# Altium project Nixie Multimeter.PrjPcb
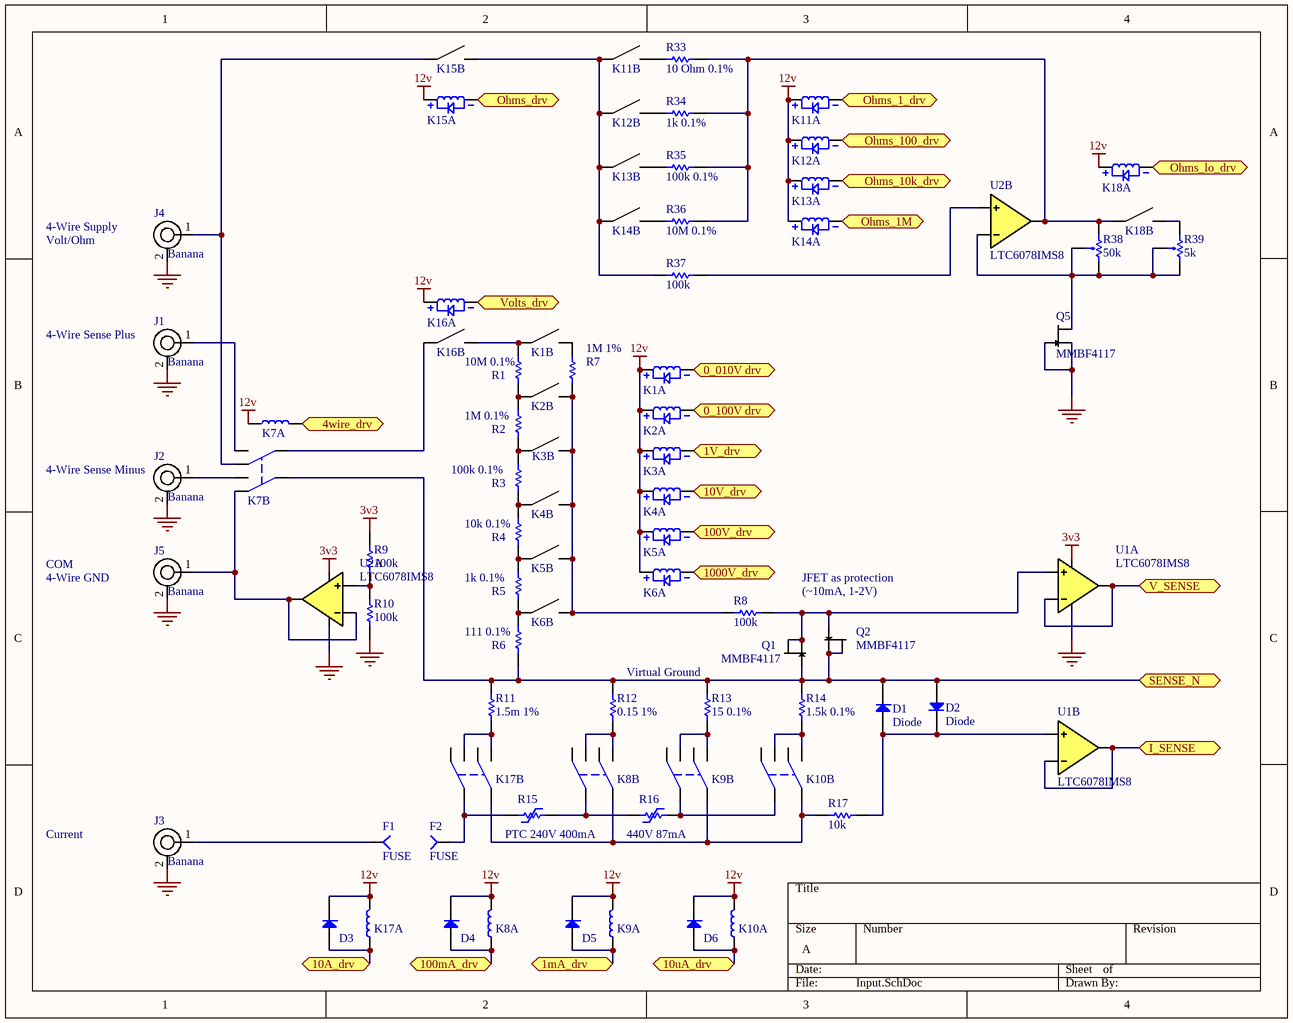
[diagram p0: Input.SchDoc]
Drawn By: Austin Hendrix
4 sheets, 108 parts. Net scope: flat (ports and power ports of the same name join across sheets).
Sheets:
  Input.SchDoc
  Boost.SchDoc
  Nixie.SchDoc
  MCU.SchDoc

## Sheet Input.SchDoc: Input
size A; DrawnBy: Austin Hendrix

### Parts
D1  Diode  [SOD80]
D2  Diode  [SOD80]
D3  Diode  [SOD80]  (value not drawn)
D4  Diode  [SOD80]  (value not drawn)
D5  Diode  [SOD80]  (value not drawn)
D6  Diode  [SOD80]  (value not drawn)
F1  FUSE  [FUSE CLIP]
F2  FUSE  [FUSE CLIP]
J1  Banana  [FCR7350]
J2  Banana  [FCR7350]
J3  Banana  [FCR7350]
J4  Banana  [FCR7350]
J5  Banana  [FCR7350]
K1  Relay Reed SPST 1000V / 500mA 12V  [Coto 9104-12-11]  (value not drawn)  (parts A,B of 2)
K2  Relay Reed SPST 500mA 12V  [HE3621A]  (value not drawn)  (parts A,B of 2)
K3  Relay Reed SPST 500mA 12V  [HE3621A]  (value not drawn)  (parts A,B of 2)
K4  Relay Reed SPST 500mA 12V  [HE3621A]  (value not drawn)  (parts A,B of 2)
K5  Relay Reed SPST 500mA 12V  [HE3621A]  (value not drawn)  (parts A,B of 2)
K6  Relay Reed SPST 500mA 12V  [HE3621A]  (value not drawn)  (parts A,B of 2)
K7  Relay DPDT 15A 12V  [K10-pcb]  (value not drawn)  (parts A,B of 2)
K8  Relay DPDT 2A 12V  [EE2-12NU]  (value not drawn)  (parts A,B of 2)
K9  Relay DPDT 2A 12V  [EE2-12NU]  (value not drawn)  (parts A,B of 2)
K10  Relay DPDT 2A 12V  [EE2-12NU]  (value not drawn)  (parts A,B of 2)
K11  Relay Reed SPST 500mA 12V  [HE3621A]  (value not drawn)  (parts A,B of 2)
K12  Relay Reed SPST 500mA 12V  [HE3621A]  (value not drawn)  (parts A,B of 2)
K13  Relay Reed SPST 500mA 12V  [HE3621A]  (value not drawn)  (parts A,B of 2)
K14  Relay Reed SPST 500mA 12V  [HE3621A]  (value not drawn)  (parts A,B of 2)
K15  Relay Reed SPST 500mA 12V  [HE3621A]  (value not drawn)  (parts A,B of 2)
K16  Relay Reed SPST 1000V / 500mA 12V  [Coto 9104-12-11]  (value not drawn)  (parts A,B of 2)
K17  Relay DPDT 15A 12V  [K10-pcb]  (value not drawn)  (parts A,B of 2)
K18  Relay Reed SPST 500mA 12V  [HE3621A]  (value not drawn)  (parts A,B of 2)
Q1  MMBF4117  [SOT_23]
Q2  MMBF4117  [SOT_23]
Q5  MMBF4117  [SOT_23]
R1  10M 0.1%  [R2010]
R2  1M 0.1%  [R1206]
R3  100k 0.1%  [R0805]
R4  10k 0.1%  [R0603]
R5  1k 0.1%  [R0603]
R6  111 0.1%  [R0402]
R7  1M 1%  [R2512]
R8  100k  [R0603]
R9  100k  [R0603]
R10  100k  [R0603]
R11  1.5m 1%  [R2512]
R12  0.15 1%  [R2010]
R13  15 0.1%  [R0805]
R14  1.5k 0.1%  [R0603]
R15  PTC 240V 400mA  [0ZRE0040FF1A]
R16  440V 87mA  [B59751C0120A070]
R17  10k  [R0603]
R33  10 Ohm 0.1%  [R0603]
R34  1k 0.1%  [R0603]
R35  100k 0.1%  [R0805]
R36  10M 0.1%  [R1206]
R37  100k  [R0603]
R38  50k  [PV36]
R39  5k  [PV36]
U1  LTC6078IMS8  [8MSOP]  (parts A,B of 2)
U2  LTC6078IMS8  [8MSOP]  (parts A,B of 2)

### Ports
0_010V drv, 0_100V drv, 1mA_drv, 1V_drv, 4wire_drv, 10A_drv, 10uA_drv, 10V_drv, 100mA_drv, 100V_drv, 1000V_drv, I_SENSE, Ohms_1_drv, Ohms_1M, Ohms_10k_drv, Ohms_100_drv, Ohms_drv, Ohms_lo_drv, SENSE_N, V_SENSE, Volts_drv

### Nets
3v3: R9.2 U1.8 U2.8
12v: D3.2(K) D4.2(K) D5.2(K) D6.2(K) K1.3 K2.2 K3.2 K4.2 K5.2 K6.2 K7.7 K8.12 K9.12 K10.12 K11.2 K12.2 K13.2 K14.2 K15.2 K16.3 K17.8 K18.2
GND: J1.2 J2.2 J3.2 J4.2 J5.2 Q5.1 Q5.3 R10.1 U1.4 U2.4
NetD1_1: D1.1(A) D2.2(K) R17.2 U1.5
NetD1_2: D1.2(K) D2.1(A) K7.6 Q1.3 Q2.1 Q2.2 R6.1 R11.2 R12.2 R13.2 R14.2 ; port SENSE_N
NetD3_1: D3.1(A) K17.7 ; port 10A_drv
NetD4_1: D4.1(A) K8.1 ; port 100mA_drv
NetD5_1: D5.1(A) K9.1 ; port 1mA_drv
NetD6_1: D6.1(A) K10.1 ; port 10uA_drv
NetF1_1: F1.1 J3.1
NetF2_1: F2.1 K17.6 R15.1
NetJ1_1: J1.1 K7.3
NetJ2_1: J2.1 K7.4
NetJ4_1: J4.1 K7.1 K15.1
NetJ5_1: J5.1 K7.2 U2.1 U2.2
NetK1_1: K1.1 K16.7 R1.2
NetK1_5: K1.5 ; port 0_010V drv
NetK1_7: K1.7 R7.2
NetK2_1: K2.1 R1.1 R2.2
NetK2_3: K2.3 ; port 0_100V drv
NetK2_4: K2.4 K3.4 K4.4 K5.4 K6.4 R7.1 R8.1
NetK3_1: K3.1 R2.1 R3.2
NetK3_3: K3.3 ; port 1V_drv
NetK4_1: K4.1 R3.1 R4.2
NetK4_3: K4.3 ; port 10V_drv
NetK5_1: K5.1 R4.1 R5.2
NetK5_3: K5.3 ; port 100V_drv
NetK6_1: K6.1 R5.1 R6.2
NetK6_3: K6.3 ; port 1000V_drv
NetK7_5: K7.5 K16.1
NetK7_8: K7.8 ; port 4wire_drv
NetK8_4: K8.4 R15.2 R16.1
NetK8_5: K8.5 K8.8 R12.1
NetK8_9: K8.9 K9.9 K10.9 K17.5 R17.1
NetK9_4: K9.4 K10.4 R16.2
NetK9_5: K9.5 K9.8 R13.1
NetK10_5: K10.5 K10.8 R14.1
NetK11_1: K11.1 K12.1 K13.1 K14.1 K15.4 R37.1
NetK11_3: K11.3 ; port Ohms_1_drv
NetK11_4: K11.4 R33.1
NetK12_3: K12.3 ; port Ohms_100_drv
NetK12_4: K12.4 R34.1
NetK13_3: K13.3 ; port Ohms_10k_drv
NetK13_4: K13.4 R35.1
NetK14_3: K14.3 ; port Ohms_1M
NetK14_4: K14.4 R36.1
NetK15_3: K15.3 ; port Ohms_drv
NetK16_5: K16.5 ; port Volts_drv
NetK17_3: K17.3 K17.4 R11.1
NetK18_1: K18.1 R33.2 R34.2 R35.2 R36.2 R38.3 U2.7
NetK18_3: K18.3 ; port Ohms_lo_drv
NetK18_4: K18.4 R39.3
NetQ1_1: Q1.1 Q1.2 Q2.3 R8.2 U1.3
NetQ5_2: Q5.2 R38.1 R38.2 R39.1 R39.2 U2.6
NetR9_1: R9.1 R10.2 U2.3
NetR37_2: R37.2 U2.5
NetU1_1: U1.1 U1.2 ; port V_SENSE
NetU1_6: U1.6 U1.7 ; port I_SENSE

Not connected (* = marked no-connect by the designer): K8 3 10; K9 3 10; K10 3 10; K17 1 2

### Notes on the sheet
- (near J4) 4-Wire Supply
- Volt/Ohm
- (near J1) 4-Wire Sense Plus
- (near J2) 4-Wire Sense Minus
- COM
- 4-Wire GND
- JFET as protection
- (~10mA, 1-2V)
- Virtual Ground
- Current

### Library data of the parts
D1 D2 = Diode 125V 200mA: DIODE GEN PURP 125V 200MA LL34; Supplier 1: Digi-Key; Supplier Part Number 1: FDLL3595CT-ND
D3-D6 = Diode 100V 200mA: DIODE GEN PURP 100V 200MA LL34; Supplier 1: Digi-Key; Supplier Part Number 1: FDLL4148CT-ND
F1 F2 = FUSE CLIP: FUSE CLIP CARTRIDGE 30A PCB; Supplier 1: Digi-Key; Supplier Part Number 1: 36-3566-ND
J1-J5 = Banana Jack: SOCKET, PCB, 4MM, R/A, S16N-PC, YEL; Supplier 1: Newark; Supplier Part Number 1: 20T2058; Supplier 2: Newark; Supplier Part Number 2: 20T2059; Supplier 3: Newark; Supplier Part Number 3: 20T2055
K1 K16 = Relay Reed SPST 1000V / 500mA 12V: RELAY REED SPST 500MA 12V; Supplier 1: Digi-Key; Supplier Part Number 1: 306-1196-ND
K7 K17 = Relay DPDT 15A 12V: RELAY GEN PURPOSE DPDT 15A 12V; Supplier 1: Digi-Key; Supplier Part Number 1: PB327-ND
K8-K10 = Relay DPDT 2A 12V: RELAY GEN PURPOSE DPDT 2A 12V; Supplier 1: Digi-Key; Supplier Part Number 1: 399-11033-5-ND
Q1 Q2 Q5 = MMBF4117: JFET N-CH 40V 0.225W SOT23; Supplier 1: Digi-Key; Supplier Part Number 1: MMBF4117CT-ND
R1 = 10M 2010 0.1%: RES SMD 10M OHM 0.1% 1W 2010; Supplier 1: Digi-Key; Supplier Part Number 1: HVCB2010BDE10M0CT-ND
R2 = 1M 1206 0.1%: RES SMD 1M OHM 0.1% 1/4W 1206; Supplier 1: Digi-Key; Supplier Part Number 1: YAG5104CT-ND
R3 R35 = 100k 0805 0.1%: RES SMD 100K OHM 0.1% 1/8W 0805; Supplier 1: Digi-Key; Supplier Part Number 1: YAG2326CT-ND
R4 = 10k 0603 0.1%: RES SMD 10K OHM 0.1% 1/10W 0603; Supplier 1: Digi-Key; Supplier Part Number 1: YAG2313CT-ND
R5 R34 = 1k 0603 0.1%: RES SMD 1K OHM 0.1% 1/10W 0603; Supplier 1: Digi-Key; Supplier Part Number 1: YAG2314CT-ND
R6 = 111 0402 0.1%: RES 111 OHM 0.1% 1/10W 0402; Supplier 1: Digi-Key; Supplier Part Number 1: 541-2065-1-ND
R7 = 1M 2512 1%: CHV2512-FX-1004ELF; Supplier 1: Digi-Key; Supplier Part Number 1: CHV2512-FX-1004ELFCT-ND
R8-R10 R37 = 100k 0603 5%: RES SMD 100K OHM 5% 1/10W 0603; Supplier 1: Digi-Key; Supplier Part Number 1: 311-100KGRCT-ND
R11 = 1.5m 2512 1%: RES 0.0015 OHM 1% 3W 2512; Supplier 1: Digi-Key; Supplier Part Number 1: 696-1184-1-ND
R12 = 0.15 2010 1%: RES 0.15 OHM 1% 1W 2010; Supplier 1: Digi-Key; Supplier Part Number 1: CSR2010FTR150CT-ND
R13 = 15 0805 0.1%: RES SMD 15 OHM 0.1% 1/8W 0805; Supplier 1: Digi-Key; Supplier Part Number 1: YAG4833CT-ND
R14 = 1.5k 0603 0.1%: RES SMD 1.5K OHM 0.1% 1/5W 0603; Supplier 1: Digi-Key; Supplier Part Number 1: P19990CT-ND
R15 = PTC 240V 400mA: PTC RESET FUSE 240V 400MA RADIAL; Supplier 1: Digi-Key; Supplier Part Number 1: 507-1354-ND
R16 = PTC 440V 87mA: PTC RESET FUSE 440V 87MA RADIAL; Supplier 1: Digi-Key; Supplier Part Number 1: 495-7219-ND
R17 = 10k 0603 5%: RES SMD 10K OHM 5% 1/10W 0603; Supplier 1: Digi-Key; Supplier Part Number 1: 311-10KGRCT-ND
R33 = 10 Ohm 0603 0.1%: RES SMD 10 OHM 0.1% 1/10W 0603; Supplier 1: Digi-Key; Supplier Part Number 1: YAG3350CT-ND
R36 = 10M 1206 0.1%: RES 10M OHM 0.1% 1/3W 1206; Supplier 1: Digi-Key; Supplier Part Number 1: HVCB1206BDE10M0CT-ND
R38 = TRIMMER 50K: TRIMMER 50K OHM 0.5W TH; Supplier 1: Digi-Key; Supplier Part Number 1: 490-2889-ND
R39 = TRIMMER 5K: TRIMMER 5K OHM 0.5W TH; Supplier 1: Digi-Key; Supplier Part Number 1: 490-2888-ND
K2-K6 K11-K15 K18 = Relay Reed SPST 500mA 12V: Supplier 1: Digi-Key; Supplier Part Number 1: HE209-ND
U1 U2 = LTC6078IMS8: Supplier 1: Digi-Key; Supplier Part Number 1: LTC6078IMS8#PBF-ND

## Sheet Boost.SchDoc
size A
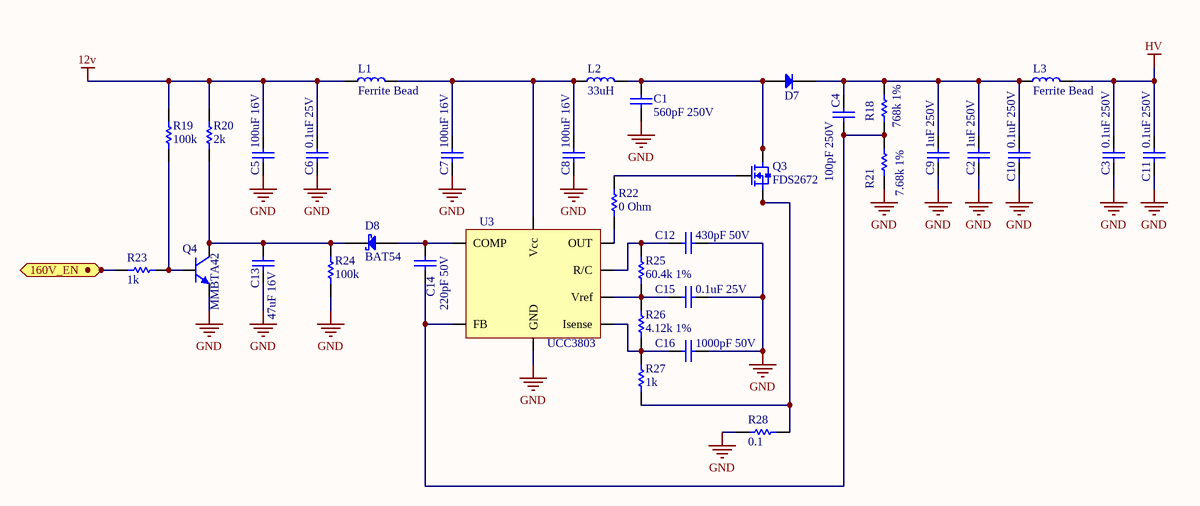
[diagram p1: Boost.SchDoc]

### Parts
C1  560pF 250V  [C0603]
C2  1uF 250V  [C2220]
C3  0.1uF 250V  [C0805]
C4  100pF 250V  [C0805]
C5  100uF 16V  [C1210]
C6  0.1uF 25V  [C0805]
C7  100uF 16V  [C1210]
C8  100uF 16V  [C1210]
C9  1uF 250V  [C2220]
C10  0.1uF 250V  [C0805]
C11  0.1uF 250V  [C0805]
C12  430pF 50V  [C0805]
C13  47uF 16V  [C1206]
C14  220pF 50V  [C0805]
C15  0.1uF 25V  [C0805]
C16  1000pF 50V  [C0805]
D7  Diode  [SMA]  (value not drawn)
D8  BAT54  [SOD-323]
L1  Ferrite Bead  [R0805]
L2  33uH  [Wurth 7447709330]
L3  Ferrite Bead  [R0805]
Q3  FDS2672  [8-SOIC]
Q4  MMBTA42  [SOT_23]
R18  768k 1%  [R0805]
R19  100k  [R0603]
R20  2k  [R0805]
R21  7.68k 1%  [R0805]
R22  0 Ohm  [R0805]
R23  1k  [R0805]
R24  100k  [R0603]
R25  60.4k 1%  [R0805]
R26  4.12k 1%  [R0805]
R27  1k  [R0805]
R28  0.1  [R0805]
U3  UCC3803  [8-SOIC]

### Ports
160V_EN

### Nets
12v: C5.2 C6.2 L1.1 R19.2 R20.2
GND: C1.1 C2.1 C3.1 C5.1 C6.1 C7.1 C8.1 C9.1 C10.1 C11.1 C12.2 C13.1 C15.2 C16.1 Q4.3(E) R21.1 R24.1 R28.1 U3.5(GND)
HV: C3.2 C11.2 L3.2
NetC1_2: C1.2 D7.1(A) L2.2 Q3.5 Q3.6 Q3.7 Q3.8
NetC2_2: C2.2 C4.2 C9.2 C10.2 D7.2(K) L3.1 R18.2
NetC4_1: C4.1 C14.1 R18.1 R21.2 U3.2(FB)
NetC7_2: C7.2 C8.2 L1.2 L2.1 U3.7(Vcc)
NetC12_1: C12.1 R25.1 U3.4(R/C)
NetC13_2: C13.2 D8.2(K) Q4.1(C) R20.1 R24.2
NetC14_2: C14.2 D8.1(A) U3.1(COMP)
NetC15_1: C15.1 R25.2 R26.1 U3.8(Vref)
NetC16_2: C16.2 R26.2 R27.1 U3.3(Isense)
NetQ3_1: Q3.1 Q3.2 Q3.3 R27.2 R28.2
NetQ3_4: Q3.4 R22.2
NetQ4_2: Q4.2(B) R19.1 R23.2
NetR22_1: R22.1 U3.6(OUT)
NetR23_1: R23.1 ; port 160V_EN

### Library data of the parts
C1 = 560pF 250V 0603: CAP CER 560PF 250V C0G/NP0 0603; Supplier 1: Digi-Key; Supplier Part Number 1: 399-11888-1-ND
C2 C9 = 1uF 250V 2220: CAP CER 1UF 250V X7R 2220; Supplier 1: Digi-Key; Supplier Part Number 1: 490-3550-1-ND
C3 C10 C11 = 0.1uF 250V 0805: CAP CER 0.1UF 250V X7T 0805; Supplier 1: Digi-Key; Supplier Part Number 1: 445-7965-1-ND
C4 = 100pF 250V 0805: CAP CER 100PF 250V C0G/NP0 0805; Supplier 1: Digi-Key; Supplier Part Number 1: 399-15000-1-ND
C5 C7 C8 = 100uF 16V 1210: CAP CER 100UF 16V X5R 1210; Supplier 1: Digi-Key; Supplier Part Number 1: 587-5426-1-ND
C6 C15 = 0.1uF 25V 0805: CAP CER 0.1UF 25V Y5V 0805; Supplier 1: Digi-Key; Supplier Part Number 1: 1276-1286-1-ND
C12 = 430pF 50V 0805: CAP CER 430PF 50V C0G/NP0 0805; Supplier 1: Digi-Key; Supplier Part Number 1: 1276-2659-1-ND
C13 = 47uF 16V 1206: CAP CER 47UF 16V JB 1206; Supplier 1: Digi-Key; Supplier Part Number 1: 445-11695-1-ND
C14 = 220pF 50V 0805: CAP CER 220PF 50V X7R 0805; Supplier 1: Digi-Key; Supplier Part Number 1: 399-8039-1-ND
C16 = 1000pF 50V 0805: CAP CER 1000PF 50V X7R 0805; Supplier 1: Digi-Key; Supplier Part Number 1: 399-1147-1-ND
D7 = Diode 200V 1A: DIODE GEN PURP 200V 1A SMA; Supplier 1: Digi-Key; Supplier Part Number 1: ES1DFSCT-ND
D8 = Diode 30V 100mA: DIODE BAT54 SCHOTTKY 30V 100MA SOD323; Supplier 1: Digi-Key; Supplier Part Number 1: BAT54WS-FDICT-ND
L1 L3 = Ferrite Bead 60 Ohm: FERRITE BEAD 60 OHM 0805 1LN; Supplier 1: Digi-Key; Supplier Part Number 1: 587-1932-1-ND
L2 = 33uH: FIXED IND 33UH 4.2A 45 MOHM SMD; Supplier 1: Digi-Key; Supplier Part Number 1: 732-1244-1-ND
Q3 = N-FET FDS2672: MOSFET N-CH 200V 3.9A 8-SOIC; Supplier 1: Digi-Key; Supplier Part Number 1: FDS2672CT-ND
Q4 = NPN 300V 0.3A: TRANS MMBTA42 NPN 300V 0.3A SOT23; Supplier 1: Digi-Key; Supplier Part Number 1: MMBTA42TPMSCT-ND
R18 = 768k 0805 1%: RES SMD 768K OHM 1% 1/8W 0805; Supplier 1: Digi-Key; Supplier Part Number 1: 311-768KCRCT-ND
R19 R24 = 100k 0603 5%: RES SMD 100K OHM 5% 1/10W 0603; Supplier 1: Digi-Key; Supplier Part Number 1: 311-100KGRCT-ND
R20 = 2k 0805 5%: RES SMD 2K OHM 5% 1/8W 0805; Supplier 1: Digi-Key; Supplier Part Number 1: RMCF0805JT2K00CT-ND
R21 = 7.68k 0805 1%: RES SMD 7.68K OHM 1% 1/8W 0805; Supplier 1: Digi-Key; Supplier Part Number 1: 311-7.68KCRCT-ND
R22 = 0 Ohm 0805: RES SMD 0 OHM JUMPER 1/8W 0805; Supplier 1: Digi-Key; Supplier Part Number 1: RMCF0805ZT0R00CT-ND
R23 R27 = 1k 0805 5%: RES SMD 1K OHM 5% 1/8W 0805; Supplier 1: Digi-Key; Supplier Part Number 1: RMCF0805JT1K00CT-ND
R25 = 60.4k 0805 1%: RES SMD 60.4K OHM 1% 1/8W 0805; Supplier 1: Digi-Key; Supplier Part Number 1: 311-60.4KCRCT-ND
R26 = 4.12k 0805 1%: RES SMD 4.12K OHM 1% 1/8W 0805; Supplier 1: Digi-Key; Supplier Part Number 1: 311-4.12KCRCT-ND
R28 = 0.1 0805 1%: RES 0.1 OHM 1% 1/2W 0805; Supplier 1: Digi-Key; Supplier Part Number 1: P19308CT-ND
U3 = UCC3803DTR: IC REG CTRLR MULT TOPOLOGY 8SOIC; Supplier 1: Digi-Key; Supplier Part Number 1: 296-38327-1-ND

## Sheet Nixie.SchDoc
size A
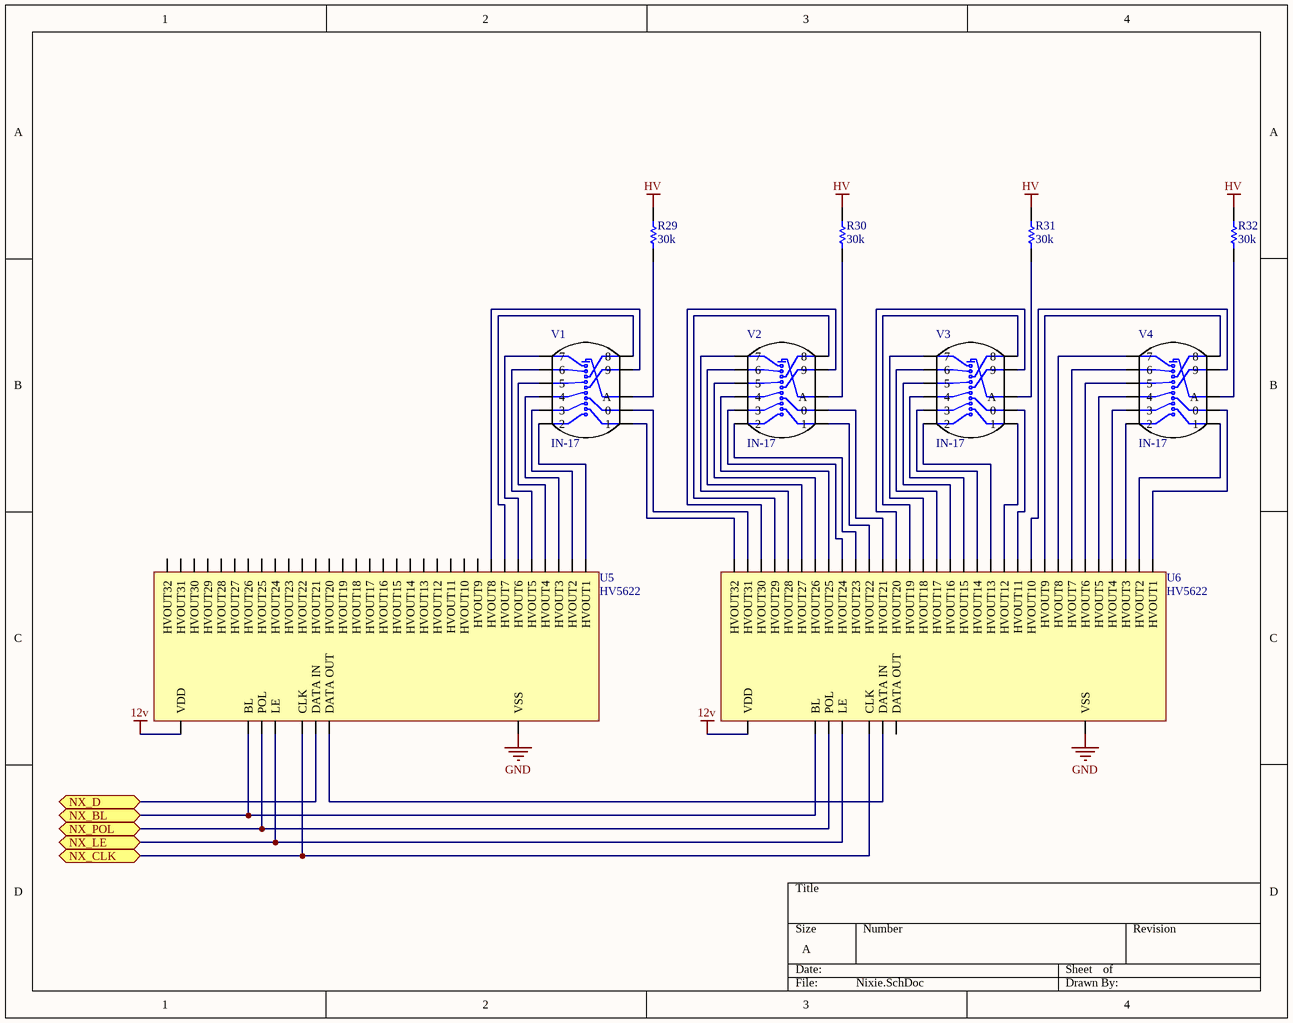
[diagram p2: Nixie.SchDoc]

### Parts
R29  30k  [R0805]
R30  30k  [R0805]
R31  30k  [R0805]
R32  30k  [R0805]
U5  HV5622  [44-PQFP]
U6  HV5622  [44-PQFP]
V1  IN-17  [IN-17]
V2  IN-17  [IN-17]
V3  IN-17  [IN-17]
V4  IN-17  [IN-17]

### Ports
NX_BL, NX_CLK, NX_D, NX_LE, NX_POL

### Nets
12v: U5.30(VDD) U6.30(VDD)
GND: U5.29(VSS) U6.29(VSS)
HV: R29.2 R30.2 R31.2 R32.2
NetR29_1: R29.1 V1.1(A)
NetR30_1: R30.1 V2.1(A)
NetR31_1: R31.1 V3.1(A)
NetR32_1: R32.1 V4.1(A)
NetU5_15: U5.15(HVOUT8) V1.11(9)
NetU5_16: U5.16(HVOUT7) V1.10(8)
NetU5_17: U5.17(HVOUT6) V1.9(7)
NetU5_18: U5.18(HVOUT5) V1.8(6)
NetU5_19: U5.19(HVOUT4) V1.7(5)
NetU5_20: U5.20(HVOUT3) V1.6(4)
NetU5_21: U5.21(HVOUT2) V1.5(3)
NetU5_22: U5.22(HVOUT1) V1.4(2)
NetU5_23: U5.23(DATA_OUT) U6.32(DATA_IN)
NetU5_27: U5.27(POL) U6.27(POL) ; port NX_POL
NetU5_28: U5.28(CLK) U6.28(CLK) ; port NX_CLK
NetU5_31: U5.31(LE) U6.31(LE) ; port NX_LE
NetU5_32: U5.32(DATA_IN) ; port NX_D
NetU5_33: U5.33(BL) U6.33(BL) ; port NX_BL
NetU6_1: U6.1(HVOUT22) V2.3(1)
NetU6_2: U6.2(HVOUT21) V2.2(0)
NetU6_3: U6.3(HVOUT20) V3.11(9)
NetU6_4: U6.4(HVOUT19) V3.10(8)
NetU6_5: U6.5(HVOUT18) V3.9(7)
NetU6_6: U6.6(HVOUT17) V3.8(6)
NetU6_7: U6.7(HVOUT16) V3.7(5)
NetU6_8: U6.8(HVOUT15) V3.6(4)
NetU6_9: U6.9(HVOUT14) V3.5(3)
NetU6_10: U6.10(HVOUT13) V3.4(2)
NetU6_11: U6.11(HVOUT12) V3.3(1)
NetU6_12: U6.12(HVOUT11) V3.2(0)
NetU6_13: U6.13(HVOUT10) V4.11(9)
NetU6_14: U6.14(HVOUT9) V4.10(8)
NetU6_15: U6.15(HVOUT8) V4.9(7)
NetU6_16: U6.16(HVOUT7) V4.8(6)
NetU6_17: U6.17(HVOUT6) V4.7(5)
NetU6_18: U6.18(HVOUT5) V4.6(4)
NetU6_19: U6.19(HVOUT4) V4.5(3)
NetU6_20: U6.20(HVOUT3) V4.4(2)
NetU6_21: U6.21(HVOUT2) V4.3(1)
NetU6_22: U6.22(HVOUT1) V4.2(0)
NetU6_35: U6.35(HVOUT32) V1.3(1)
NetU6_36: U6.36(HVOUT31) V1.2(0)
NetU6_37: U6.37(HVOUT30) V2.11(9)
NetU6_38: U6.38(HVOUT29) V2.10(8)
NetU6_39: U6.39(HVOUT28) V2.9(7)
NetU6_40: U6.40(HVOUT27) V2.8(6)
NetU6_41: U6.41(HVOUT26) V2.7(5)
NetU6_42: U6.42(HVOUT25) V2.6(4)
NetU6_43: U6.43(HVOUT24) V2.5(3)
NetU6_44: U6.44(HVOUT23) V2.4(2)

Not connected (* = marked no-connect by the designer): U5 1(HVOUT22) 2(HVOUT21) 3(HVOUT20) 4(HVOUT19) 5(HVOUT18) 6(HVOUT17) 7(HVOUT16) 8(HVOUT15) 9(HVOUT14) 10(HVOUT13) 11(HVOUT12) 12(HVOUT11) 13(HVOUT10) 14(HVOUT9) 35(HVOUT32) 36(HVOUT31) 37(HVOUT30) 38(HVOUT29) 39(HVOUT28) 40(HVOUT27) 41(HVOUT26) 42(HVOUT25) 43(HVOUT24) 44(HVOUT23); U6 23(DATA_OUT)

### Library data of the parts
R29-R32 = 30k 0805 5%: RES SMD 30K OHM 5% 1/8W 0805; Supplier 1: Digi-Key; Supplier Part Number 1: RMCF0805JT30K0CT-ND
U5 U6 = HV5622: IC 32BIT SRL PARALLEL 220V 44PQF; Supplier 1: Digi-Key; Supplier Part Number 1: HV5622PG-G-ND
V1-V4 = IN-17 Nixie: IN-17 Nixie Display Tube

## Sheet MCU.SchDoc
size A
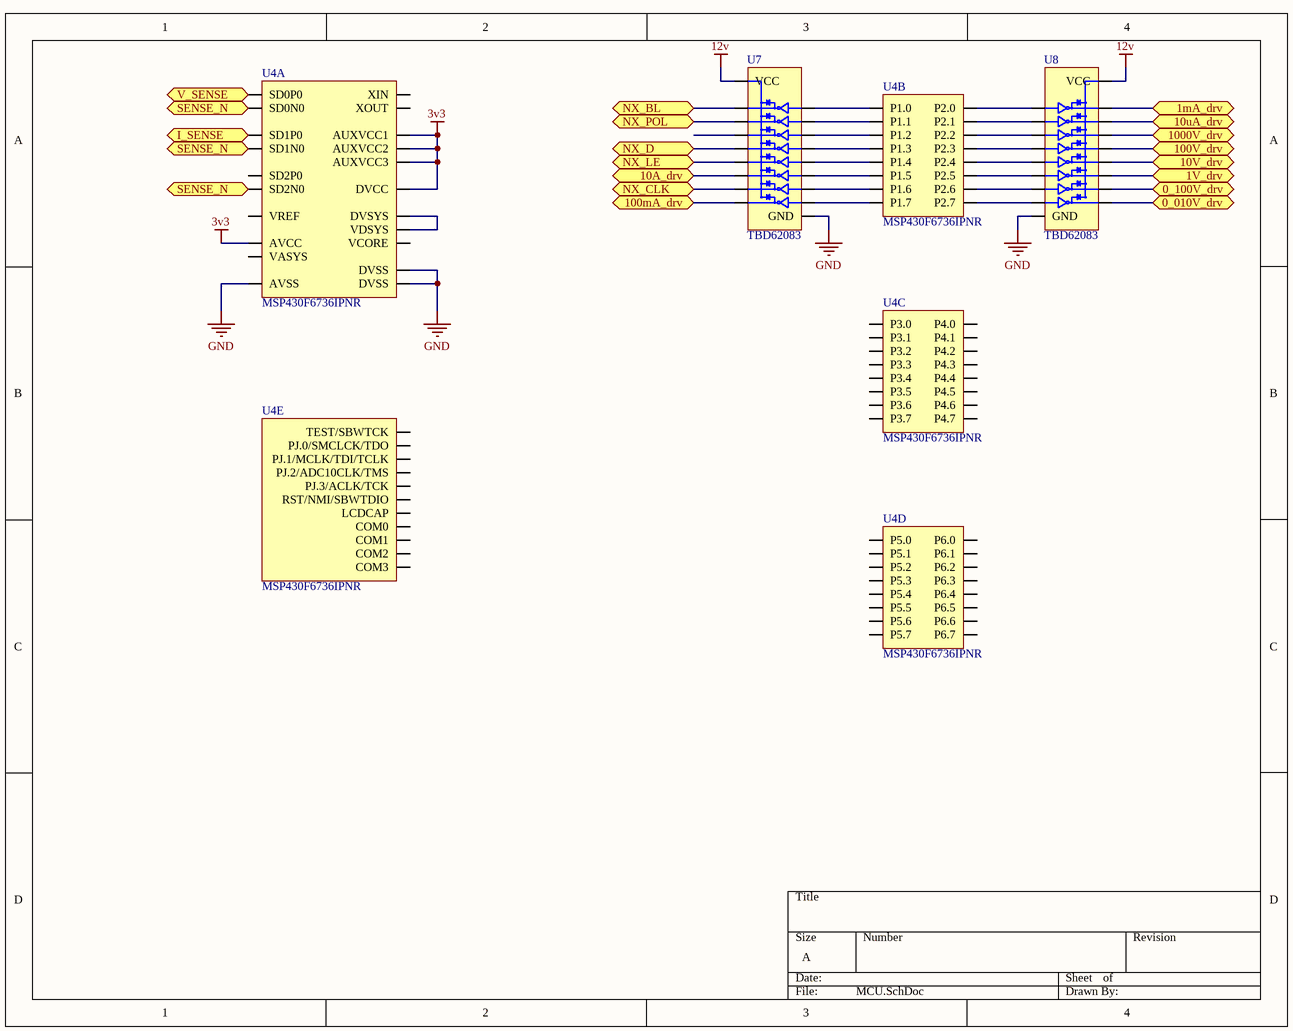
[diagram p3: MCU.SchDoc]

### Parts
U4  MSP430F6736IPNR  [80-LQFP]  (parts A,B,C,D,E of 5)
U7  TBD62083  [18-SOIC]
U8  TBD62083  [18-SOIC]

### Ports
0_010V_drv, 0_100V_drv, 1mA_drv, 1V_drv, 10A_drv, 10uA_drv, 10V_drv, 100mA_drv, 100V_drv, 1000V_drv, I_SENSE, NX_BL, NX_CLK, NX_D, NX_LE, NX_POL, SENSE_N, V_SENSE

### Nets
3v3: U4.9(AVCC) U4.15(AUXVCC2) U4.16(AUXVCC1) U4.18(DVCC) U4.23(AUXVCC3)
12v: U7.10(VCC) U8.10(VCC)
GND: U4.8(AVSS) U4.19(DVSS) U4.60(DVSS) U7.9(GND) U8.9(GND)
NetD1_2: U4.2(SD0N0) U4.4(SD1N0) U4.6(SD2N0) ; port SENSE_N
NetD3_1: U7.13(O6) ; port 10A_drv
NetD4_1: U7.11(O8) ; port 100mA_drv
NetD5_1: U8.18(O1) ; port 1mA_drv
NetD6_1: U8.17(O2) ; port 10uA_drv
NetK3_3: U8.13(O6) ; port 1V_drv
NetK4_3: U8.14(O5) ; port 10V_drv
NetK5_3: U8.15(O4) ; port 100V_drv
NetK6_3: U8.16(O3) ; port 1000V_drv
NetU1_1: U4.1(SD0P0) ; port V_SENSE
NetU1_6: U4.3(SD1P0) ; port I_SENSE
NetU4_11: U4.11(P1.0) U7.1(I1)
NetU4_12: U4.12(P1.1) U7.2(I2)
NetU4_13: U4.13(P1.2) U7.3(I3)
NetU4_14: U4.14(P1.3) U7.4(I4)
NetU4_17: U4.17(VDSYS) U4.59(DVSYS)
NetU4_24: U4.24(P1.4) U7.5(I5)
NetU4_25: U4.25(P1.5) U7.6(I6)
NetU4_31: U4.31(P1.6) U7.7(I7)
NetU4_32: U4.32(P1.7) U7.8(I8)
NetU4_33: U4.33(P2.0) U8.1(I1)
NetU4_34: U4.34(P2.1) U8.2(I2)
NetU4_35: U4.35(P2.2) U8.3(I3)
NetU4_36: U4.36(P2.3) U8.4(I4)
NetU4_37: U4.37(P2.4) U8.5(I5)
NetU4_38: U4.38(P2.5) U8.6(I6)
NetU4_39: U4.39(P2.6) U8.7(I7)
NetU4_40: U4.40(P2.7) U8.8(I8)
NetU5_27: U7.17(O2) ; port NX_POL
NetU5_28: U7.12(O7) ; port NX_CLK
NetU5_31: U7.14(O5) ; port NX_LE
NetU5_32: U7.15(O4) ; port NX_D
NetU5_33: U7.18(O1) ; port NX_BL
NetU8_11: U8.11(O8) ; port 0_010V_drv
NetU8_12: U8.12(O7) ; port 0_100V_drv

Not connected (* = marked no-connect by the designer): U4 5(SD2P0) 7(VREF) 10(VASYS) 20(VCORE) 21(XIN) 22(XOUT) 26(LCDCAP) 27(COM0) 28(COM1) 29(COM2) 30(COM3) 41(P3.0) 42(P3.1) 43(P3.2) 44(P3.3) 45(P3.4) 46(P3.5) 47(P3.6) 48(P3.7) 49(P4.0) 50(P4.1) 51(P4.2) 52(P4.3) 53(P4.4) 54(P4.5) 55(P4.6) 56(P4.7) 57(P5.0) 58(P5.1) 61(P5.2) 62(P5.3) 63(P5.4) 64(P5.5) 65(P5.6) 66(P5.7) 67(P6.0) 68(P6.1) 69(P6.2) 70(P6.3) 71(P6.4) 72(P6.5) 73(P6.6) 74(P6.7) 75(TEST/SBWTCK) 76(PJ.0/SMCLCK/TDO) 77(PJ.1/MCLK/TDI/TCLK) 78(PJ.2/ADC10CLK/TMS) 79(PJ.3/ACLK/TCK) 80(RST/NMI/SBWTDIO); U7 16(O3)

### Library data of the parts
U4 = MSP430 F6736IPNR: IC MCU 16BIT 128KB FLASH 80LQFP; Supplier 1: Digi-Key; Supplier Part Number 1: 296-30130-1-ND; Supplier 2: Digi-Key; Supplier Part Number 2: 296-30427-ND
U7 U8 = TBD62083: IC LOAD SWITCH 8CH 0.5A 18SOP; Supplier 1: Digi-Key; Supplier Part Number 1: TBD62083AFWGELCT-ND

## Nets that join several sheets
3v3: Input (R9.2 U1.8 U2.8), MCU (5 pins)
12v: Input (22 pins), Boost (5 pins), Nixie (U5.30 U6.30), MCU (U7.10 U8.10)
GND: Input (10 pins), Boost (19 pins), Nixie (U5.29 U6.29), MCU (5 pins)
HV: Boost (C3.2 C11.2 L3.2), Nixie (R29.2 R30.2 R31.2 R32.2)
NetD1_2: Input (11 pins), MCU (U4.2 U4.4 U4.6)
NetD3_1: Input (D3.1 K17.7), MCU (U7.13)
NetD4_1: Input (D4.1 K8.1), MCU (U7.11)
NetD5_1: Input (D5.1 K9.1), MCU (U8.18)
NetD6_1: Input (D6.1 K10.1), MCU (U8.17)
NetK3_3: Input (K3.3), MCU (U8.13)
NetK4_3: Input (K4.3), MCU (U8.14)
NetK5_3: Input (K5.3), MCU (U8.15)
NetK6_3: Input (K6.3), MCU (U8.16)
NetU1_1: Input (U1.1 U1.2), MCU (U4.1)
NetU1_6: Input (U1.6 U1.7), MCU (U4.3)
NetU5_27: Nixie (U5.27 U6.27), MCU (U7.17)
NetU5_28: Nixie (U5.28 U6.28), MCU (U7.12)
NetU5_31: Nixie (U5.31 U6.31), MCU (U7.14)
NetU5_32: Nixie (U5.32), MCU (U7.15)
NetU5_33: Nixie (U5.33 U6.33), MCU (U7.18)